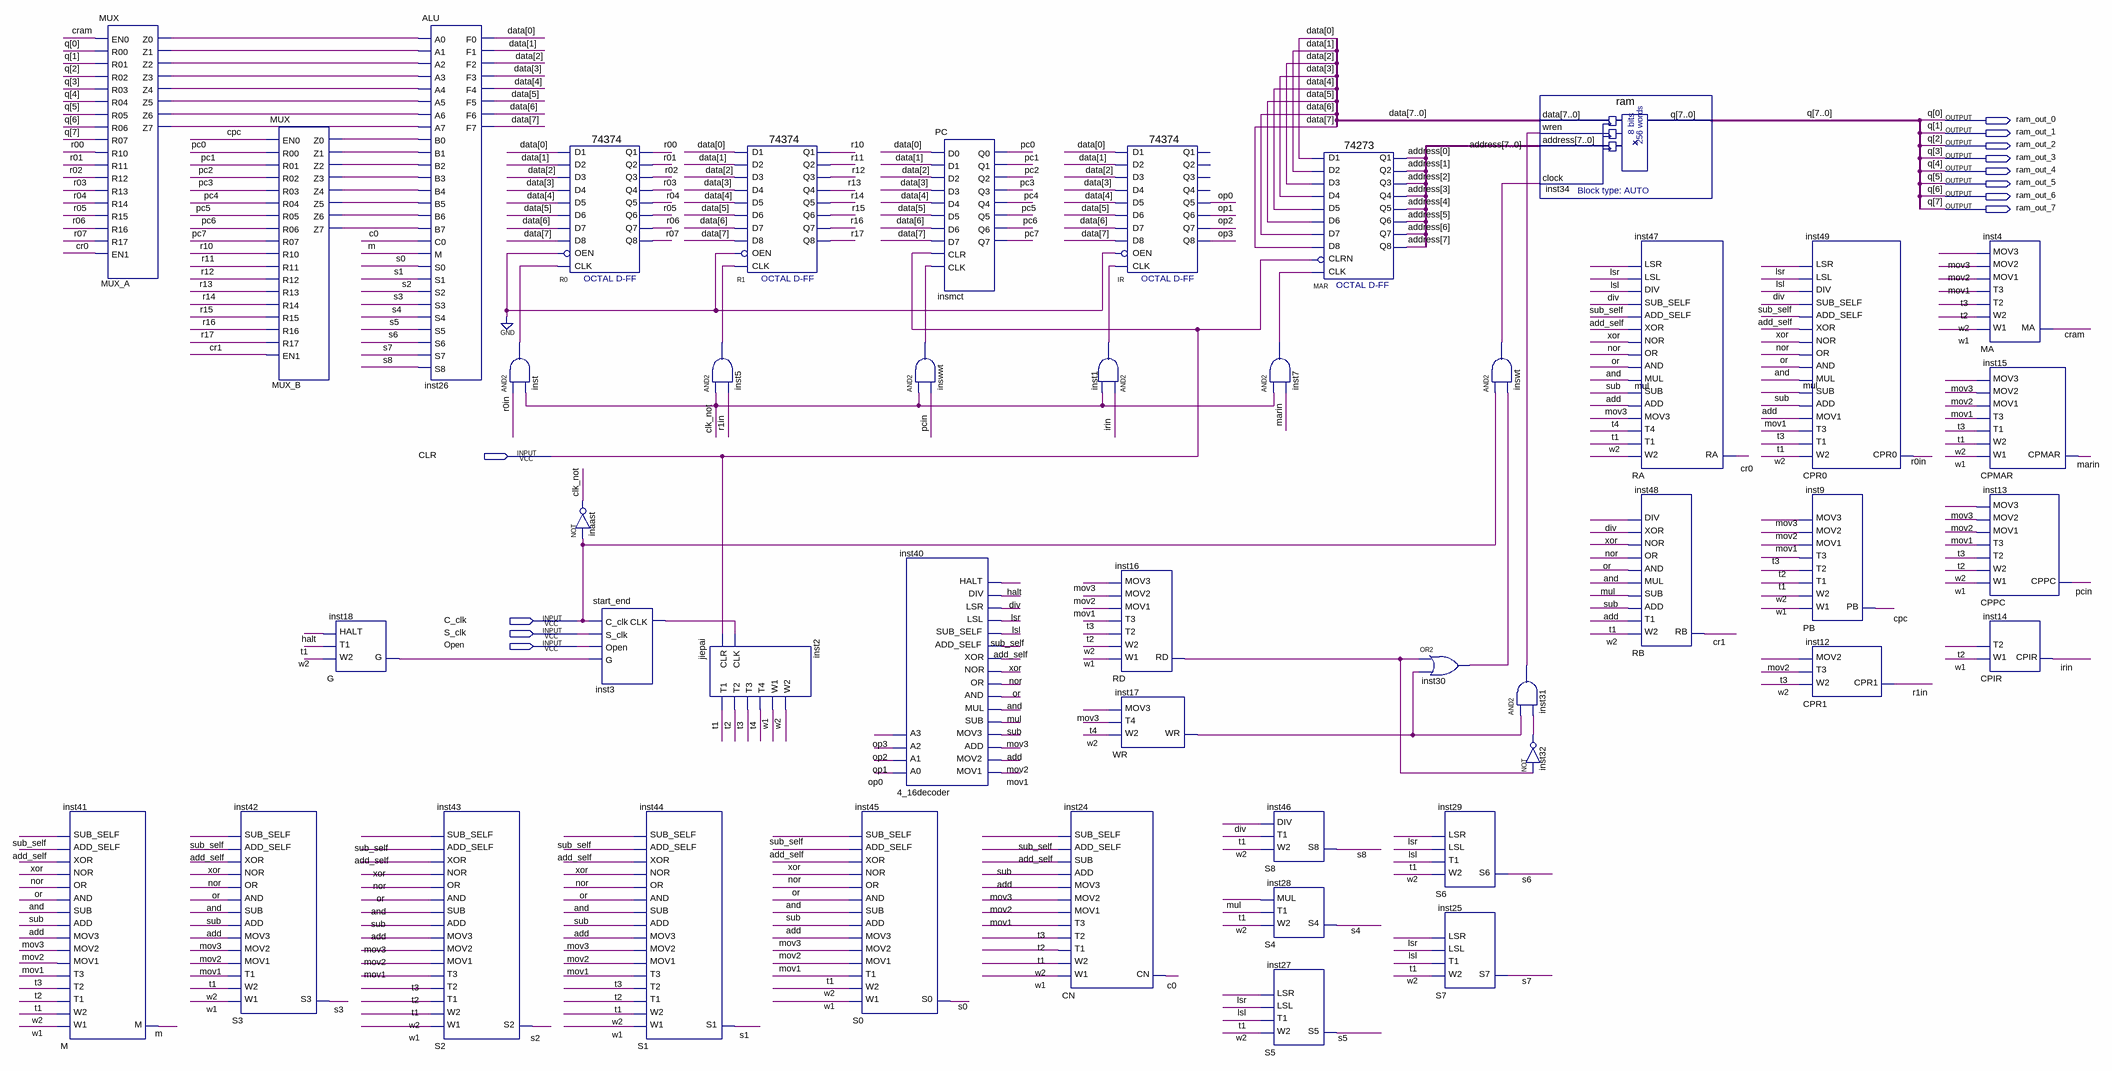
[diagram p0: schematic sheet]
// Quartus schematic test4.bdf as structural Verilog: 45 symbols, 12 pins
module test4 (
  input  CLR,
  input  C_clk,
  input  S_clk,
  input  Open,
  output ram_out_0,
  output ram_out_1,
  output ram_out_2,
  output ram_out_3,
  output ram_out_4,
  output ram_out_5,
  output ram_out_6,
  output ram_out_7
);

  wire add, add_self, \and , c0, clk_not, cpc, cr0, cr1, cram, div, halt, inst1_out, inst3_clk, inst5_out,
       inst7_out, inst16_rd, inst17_wr, inst18_g, inst30_out, inst31_out, inst32_out, inst_out, inswt_out,
       inswwt_out, irin, lsl, lsr, m, marin, mov1, mov2, mov3, mul, MUX_A_z0, MUX_A_z1, MUX_A_z2, MUX_A_z3,
       MUX_A_z4, MUX_A_z5, MUX_A_z6, MUX_A_z7, MUX_B_z0, MUX_B_z1, MUX_B_z2, MUX_B_z3, MUX_B_z4, MUX_B_z5,
       MUX_B_z6, MUX_B_z7, \nor , op0, op1, op2, op3, \or , pc0, pc1, pc2, pc3, pc4, pc5, pc6, pc7, pcin,
       r00, r0in, r01, r1in, r02, r03, r04, r05, r06, r07, r10, r11, r12, r13, r14, r15, r16, r17, s0, s1,
       s2, s3, s4, s5, s6, s7, s8, sub, sub_self, t1, t2, t3, t4, w1, w2, \xor ;
  wire [7:0] address, data;

  M inst41 (
    .W1(w1), .W2(w2), .T1(t1), .T2(t2), .T3(t3), .MOV1(mov1), .MOV2(mov2), .MOV3(mov3), .ADD(add), .SUB(sub),
    .AND(\and ), .OR(\or ), .NOR(\nor ), .XOR(\xor ), .ADD_SELF(add_self), .SUB_SELF(sub_self), .M(m));
  MUX MUX_A (
    .EN0(cram), .R00(ram_out_0), .R01(ram_out_1), .R02(ram_out_2), .R03(ram_out_3), .R04(ram_out_4),
    .R05(ram_out_5), .R06(ram_out_6), .R07(ram_out_7), .R10(r00), .R11(r01), .R12(r02), .R13(r03), .R14(r04),
    .R15(r05), .R16(r06), .R17(r07), .EN1(cr0), .Z0(MUX_A_z0), .Z1(MUX_A_z1), .Z2(MUX_A_z2), .Z3(MUX_A_z3),
    .Z4(MUX_A_z4), .Z5(MUX_A_z5), .Z6(MUX_A_z6), .Z7(MUX_A_z7));
  S3 inst42 (
    .W1(w1), .W2(w2), .T1(t1), .MOV1(mov1), .MOV2(mov2), .MOV3(mov3), .ADD(add), .SUB(sub), .AND(\and ),
    .OR(\or ), .NOR(\nor ), .XOR(\xor ), .ADD_SELF(add_self), .SUB_SELF(sub_self), .S3(s3));
  MUX MUX_B (
    .EN0(cpc), .R00(pc0), .R01(pc1), .R02(pc2), .R03(pc3), .R04(pc4), .R05(pc5), .R06(pc6), .R07(pc7),
    .R10(r10), .R11(r11), .R12(r12), .R13(r13), .R14(r14), .R15(r15), .R16(r16), .R17(r17), .EN1(cr1),
    .Z0(MUX_B_z0), .Z1(MUX_B_z1), .Z2(MUX_B_z2), .Z3(MUX_B_z3), .Z4(MUX_B_z4), .Z5(MUX_B_z5), .Z6(MUX_B_z6),
    .Z7(MUX_B_z7));
  G inst18 (.W2(w2), .T1(t1), .HALT(halt), .G(inst18_g));
  ALU inst26 (
    .A0(MUX_A_z0), .A1(MUX_A_z1), .A2(MUX_A_z2), .A3(MUX_A_z3), .A4(MUX_A_z4), .A5(MUX_A_z5), .A6(MUX_A_z6),
    .A7(MUX_A_z7), .B0(MUX_B_z0), .B1(MUX_B_z1), .B2(MUX_B_z2), .B3(MUX_B_z3), .B4(MUX_B_z4), .B5(MUX_B_z5),
    .B6(MUX_B_z6), .B7(MUX_B_z7), .C0(c0), .M(m), .S0(s0), .S1(s1), .S2(s2), .S3(s3), .S4(s4), .S5(s5),
    .S6(s6), .S7(s7), .S8(s8), .F0(data[0]), .F1(data[1]), .F2(data[2]), .F3(data[3]), .F4(data[4]),
    .F5(data[5]), .F6(data[6]), .F7(data[7]));
  S2 inst43 (
    .W1(w1), .W2(w2), .T1(t1), .T2(t2), .T3(t3), .MOV1(mov1), .MOV2(mov2), .MOV3(mov3), .ADD(add), .SUB(sub),
    .AND(\and ), .OR(\or ), .NOR(\nor ), .XOR(\xor ), .ADD_SELF(add_self), .SUB_SELF(sub_self), .S2(s2));
  and inst (inst_out, r0in, clk_not);
  \74374  R0 (
    .D1(data[0]), .D2(data[1]), .D3(data[2]), .D4(data[3]), .D6(data[5]), .D5(data[4]), .OEN(1'b0),
    .D8(data[7]), .D7(data[6]), .CLK(inst_out), .Q2(r01), .Q3(r02), .Q5(r04), .Q4(r03), .Q6(r05), .Q7(r06),
    .Q8(r07), .Q1(r00));
  not inaast (clk_not, C_clk);
  start_end inst3 (.C_clk(C_clk), .S_clk(S_clk), .Open(Open), .G(inst18_g), .CLK(inst3_clk));
  S1 inst44 (
    .W1(w1), .W2(w2), .T1(t1), .T2(t2), .T3(t3), .MOV1(mov1), .MOV2(mov2), .MOV3(mov3), .ADD(add), .SUB(sub),
    .AND(\and ), .OR(\or ), .NOR(\nor ), .XOR(\xor ), .ADD_SELF(add_self), .SUB_SELF(sub_self), .S1(s1));
  jiepai inst2 (.CLR(CLR), .CLK(inst3_clk), .T1(t1), .T2(t2), .T3(t3), .T4(t4), .W1(w1), .W2(w2));
  \74374  R1 (
    .D1(data[0]), .D2(data[1]), .D3(data[2]), .D4(data[3]), .D6(data[5]), .D5(data[4]), .OEN(1'b0),
    .D8(data[7]), .D7(data[6]), .CLK(inst5_out), .Q2(r11), .Q3(r12), .Q5(r14), .Q4(r13), .Q6(r15), .Q7(r16),
    .Q8(r17), .Q1(r10));
  and inst5 (inst5_out, clk_not, r1in);
  S0 inst45 (
    .W1(w1), .W2(w2), .T1(t1), .MOV1(mov1), .MOV2(mov2), .MOV3(mov3), .ADD(add), .SUB(sub), .AND(\and ),
    .OR(\or ), .NOR(\nor ), .XOR(\xor ), .ADD_SELF(add_self), .SUB_SELF(sub_self), .S0(s0));
  \4_16decoder  inst40 (
    .A0(op0), .A1(op1), .A2(op2), .A3(op3), .MOV1(mov1), .MOV2(mov2), .ADD(add), .MOV3(mov3), .SUB(sub),
    .MUL(mul), .AND(\and ), .OR(\or ), .NOR(\nor ), .XOR(\xor ), .ADD_SELF(add_self), .SUB_SELF(sub_self),
    .LSL(lsl), .LSR(lsr), .DIV(div), .HALT(halt));
  PC insmct (
    .D0(data[0]), .D1(data[1]), .D2(data[2]), .D3(data[3]), .D4(data[4]), .D5(data[5]), .D6(data[6]),
    .D7(data[7]), .CLR(CLR), .CLK(inswwt_out), .Q0(pc0), .Q1(pc1), .Q2(pc2), .Q3(pc3), .Q4(pc4), .Q5(pc5),
    .Q6(pc6), .Q7(pc7));
  and inswwt (inswwt_out, clk_not, pcin);
  and inst1 (inst1_out, irin, clk_not);
  CN inst24 (
    .W1(w1), .W2(w2), .T1(t1), .T2(t2), .T3(t3), .MOV1(mov1), .MOV2(mov2), .MOV3(mov3), .ADD(add), .SUB(sub),
    .ADD_SELF(add_self), .SUB_SELF(sub_self), .CN(c0));
  \74374  IR (
    .D1(data[0]), .D2(data[1]), .D3(data[2]), .D4(data[3]), .D6(data[5]), .D5(data[4]), .OEN(1'b0),
    .D8(data[7]), .D7(data[6]), .CLK(inst1_out), .Q5(op0), .Q6(op1), .Q7(op2), .Q8(op3));  // open: Q2, Q3, Q4, Q1
  RD inst16 (.W1(w1), .W2(w2), .T2(t2), .T3(t3), .MOV1(mov1), .MOV2(mov2), .MOV3(mov3), .RD(inst16_rd));
  WR inst17 (.W2(w2), .T4(t4), .MOV3(mov3), .WR(inst17_wr));
  and inst7 (inst7_out, clk_not, marin);
  S8 inst46 (.W2(w2), .T1(t1), .DIV(div), .S8(s8));
  S4 inst28 (.W2(w2), .T1(t1), .MUL(mul), .S4(s4));
  S5 inst27 (.W2(w2), .T1(t1), .LSL(lsl), .LSR(lsr), .S5(s5));
  \74273  MAR (
    .D2(data[1]), .D3(data[2]), .D1(data[0]), .D4(data[3]), .D7(data[6]), .D6(data[5]), .D5(data[4]),
    .D8(data[7]), .CLK(inst7_out), .CLRN(CLR), .Q4(address[3]), .Q1(address[0]), .Q2(address[1]),
    .Q3(address[2]), .Q6(address[5]), .Q5(address[4]), .Q7(address[6]), .Q8(address[7]));
  or inst30 (inst30_out, inst16_rd, inst17_wr);
  S6 inst29 (.W2(w2), .T1(t1), .LSL(lsl), .LSR(lsr), .S6(s6));
  S7 inst25 (.W2(w2), .T1(t1), .LSL(lsl), .LSR(lsr), .S7(s7));
  and inswt (inswt_out, C_clk, inst30_out);
  and inst31 (inst31_out, inst17_wr, inst32_out);
  ram inst34 (
    .data(data), .wren(inst31_out), .address(address), .clock(inswt_out),
    .q({ram_out_7, ram_out_6, ram_out_5, ram_out_4, ram_out_3, ram_out_2, ram_out_1, ram_out_0}));
  not inst32 (inst32_out, inst16_rd);
  RA inst47 (
    .W2(w2), .T1(t1), .T4(t4), .MOV3(mov3), .ADD(add), .SUB(sub), .MUL(mul), .AND(\and ), .OR(\or ),
    .NOR(\nor ), .XOR(\xor ), .ADD_SELF(add_self), .SUB_SELF(sub_self), .DIV(div), .LSL(lsl), .LSR(lsr),
    .RA(cr0));
  RB inst48 (
    .W2(w2), .T1(t1), .ADD(add), .SUB(sub), .MUL(mul), .AND(\and ), .OR(\or ), .NOR(\nor ), .XOR(\xor ),
    .DIV(div), .RB(cr1));
  CPR0 inst49 (
    .W2(w2), .T1(t1), .T3(t3), .MOV1(mov1), .ADD(add), .SUB(sub), .MUL(mul), .AND(\and ), .OR(\or ),
    .NOR(\nor ), .XOR(\xor ), .ADD_SELF(add_self), .SUB_SELF(sub_self), .DIV(div), .LSL(lsl), .LSR(lsr),
    .CPR0(r0in));
  PB inst9 (.W1(w1), .W2(w2), .T1(t1), .T2(t2), .T3(t3), .MOV1(mov1), .MOV2(mov2), .MOV3(mov3), .PB(cpc));
  CPR1 inst12 (.W2(w2), .T3(t3), .MOV2(mov2), .CPR1(r1in));
  MA inst4 (.W1(w1), .W2(w2), .T2(t2), .T3(t3), .MOV1(mov1), .MOV2(mov2), .MOV3(mov3), .MA(cram));
  CPMAR inst15 (.W1(w1), .W2(w2), .T1(t1), .T3(t3), .MOV1(mov1), .MOV2(mov2), .MOV3(mov3), .CPMAR(marin));
  CPPC inst13 (.W1(w1), .W2(w2), .T2(t2), .T3(t3), .MOV1(mov1), .MOV2(mov2), .MOV3(mov3), .CPPC(pcin));
  CPIR inst14 (.W1(w1), .T2(t2), .CPIR(irin));

  // Other names for the same wires on the sheet: q[7:0] = {ram_out_7, ram_out_6, ram_out_5, ram_out_4, ram_out_3, ram_out_2, ram_out_1, ram_out_0}
endmodule
